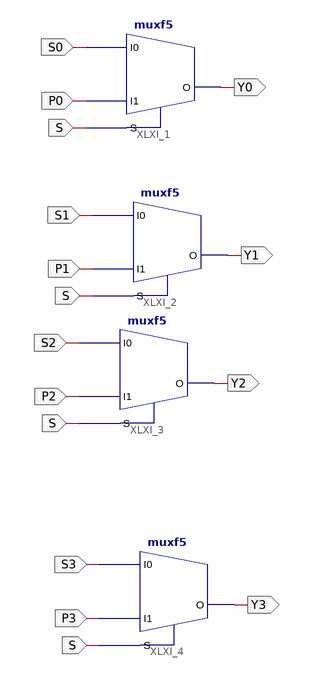
[diagram p0: schematic sheet 1]
// Xilinx ISE schematic Mymux.sch (spartan3e) as structural Verilog: 4 symbols, 13 ports
module Mymux (
  input  S0,
  input  P0,
  input  S,
  input  S1,
  input  S2,
  input  P2,
  input  S3,
  input  P3,
  input  P1,
  output Y0,
  output Y1,
  output Y3,
  output Y2
);

  muxf5 XLXI_1 (.I0(S0), .I1(P0), .S(S), .O(Y0));
  muxf5 XLXI_2 (.I0(S1), .I1(P1), .S(S), .O(Y1));
  muxf5 XLXI_3 (.I0(S2), .I1(P2), .S(S), .O(Y2));
  muxf5 XLXI_4 (.I0(S3), .I1(P3), .S(S), .O(Y3));
endmodule
